# Altium schematic sheet Power Distribution - Solar Sense, Telemetry, and Motor Interface.SchDoc: Title
size B; Organization: Midnight Sun Solar Rayce Car Team; Address1: University of Waterloo; Address2: 200 University Ave W; Address3: Waterloo, ON, Canada; Address4: N2L 3E9; Website: www.uwmidsun.com; ProjectName: ProjectName
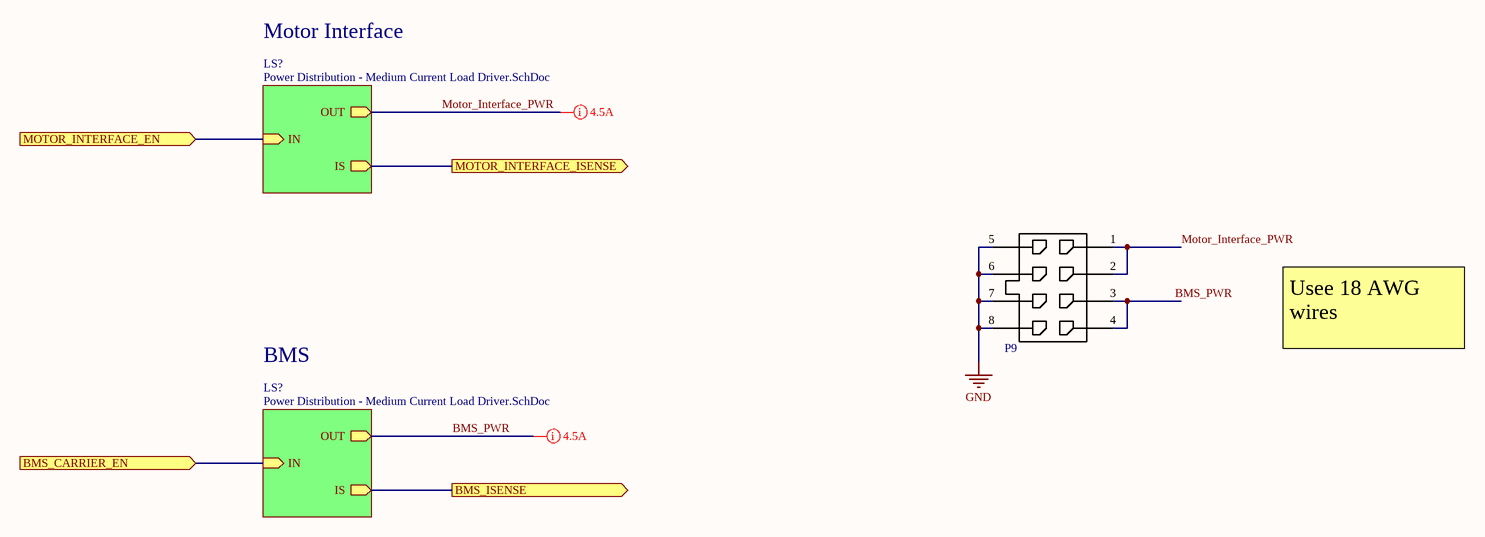
[diagram p0: Power Distribution - Solar Sense, Telemetry, and Motor Interface.SchDoc]

## Parts
P9  CONN 8POS MICRO-FIT 3mm  [CONN, 8POS MICRO-FIT]  (value not drawn)

## Sub-sheets
LS? = Power Distribution - Medium Current Load Driver.SchDoc: IN (in), IS (out), OUT (out)
LS? = Power Distribution - Medium Current Load Driver.SchDoc: IN (in), IS (out), OUT (out)

## Ports
BMS_CARRIER_EN (in), BMS_ISENSE (out), MOTOR_INTERFACE_EN (in), MOTOR_INTERFACE_ISENSE (out)

## Nets
GND: P9.5 P9.6 P9.7 P9.8
BMS_CARRIER_EN: port BMS_CARRIER_EN, sheet LS?/IN
BMS_ISENSE: port BMS_ISENSE, sheet LS?/IS
BMS_PWR: P9.3 P9.4 ; sheet LS?/OUT
MOTOR_INTERFACE_EN: port MOTOR_INTERFACE_EN, sheet LS?/IN
MOTOR_INTERFACE_ISENSE: port MOTOR_INTERFACE_ISENSE, sheet LS?/IS
Motor_Interface_PWR: P9.1 P9.2 ; sheet LS?/OUT

## Layout directives
mark named 4.5A: BMS_PWR, Motor_Interface_PWR

## Notes on the sheet
- Motor Interface
- BMS
- Usee 18 AWG wires
- PROJECT
- DOCUMENT
- DRAWN BY
- LAST MODIFIED
- PART NUMBER
- REVISION
- SHEET
- VARIANT
- OF
- Engineering 5 - 1002
  University of Waterloo
  (519) 888-4567 x32978
  hardware@uwmidsun.com

## Library data of the parts
P9 = CONN 8POS MICRO-FIT 3mm: Connector Header Through Hole 6 position 0.118" (3.00mm); Manufacturer: Molex, LLC; Manufacturer Part Number: 0430450827; Number of Positions: 6; Number of Positions Loaded: All; Style: Board to Cable/Wire; Shrouding: Shrouded - 4 Wall; Contact Length - Post: 0.125" (3.18mm); Material Flammability Rating: UL94 V-0; RoHS: RoHS Compliant; Category: Connectors, Interconnects; Packaging: Tray; Part Status: Active; Connector Type: Header; Contact Type: Male Pin; Pitch - Mating: 0.118" (3.00mm); Number of Rows: 2; Row Spacing - Mating: 0.118" (3.00mm); Mounting Type: Through Hole; Termination: Solder; Fastening Type: Locking Ramp; Contact Length - Mating: -; Overall Contact Length: -; Insulation Height: 0.390" (9.91mm); Contact Shape: Square; Contact Finish - Mating: Tin; Contact Finish Thickness - Mating: 60.0µin (1.52µm); Contact Finish - Post: Tin; Contact Material: Brass; Insulation Material: Liquid Crystal Polymer (LCP), Glass Filled; Features: Board Guide; Operating Temperature: -; Ingress Protection: -; Insulation Color: Black; Current Rating: -; Voltage Rating: -; Mated Stacking Heights: -; Contact Finish Thickness - Post: -; Applications: General Purpose, Medical, Military, Telecommunications; Supplier 1: Digi-Key; Stock 1: 5553; Pricing 1: 1=2.69, 10=2.445, 25=2.2964, 50=2.1964, 100=2.0965, 250=1.8968, 500=1.74704, 1440=1.49746, 2880=1.39763 (CAD); Supplier Part Number 1: WM10684-ND; ComponentLink1Description: https://www.molex.com/pdm_docs/ps/PS-43045.pdf; ComponentLink1URL: https://www.molex.com/pdm_docs/ps/PS-43045.pdf; ComponentLink2Description: https://www.molex.com/webdocs/datasheets/pdf/en-us/0430450827_PCB_HEADERS.pdf; ComponentLink2URL: https://www.molex.com/webdocs/datasheets/pdf/en-us/0430450827_PCB_HEADERS.pdf